# EAGLE design logic (EAGLE 8.4.3)
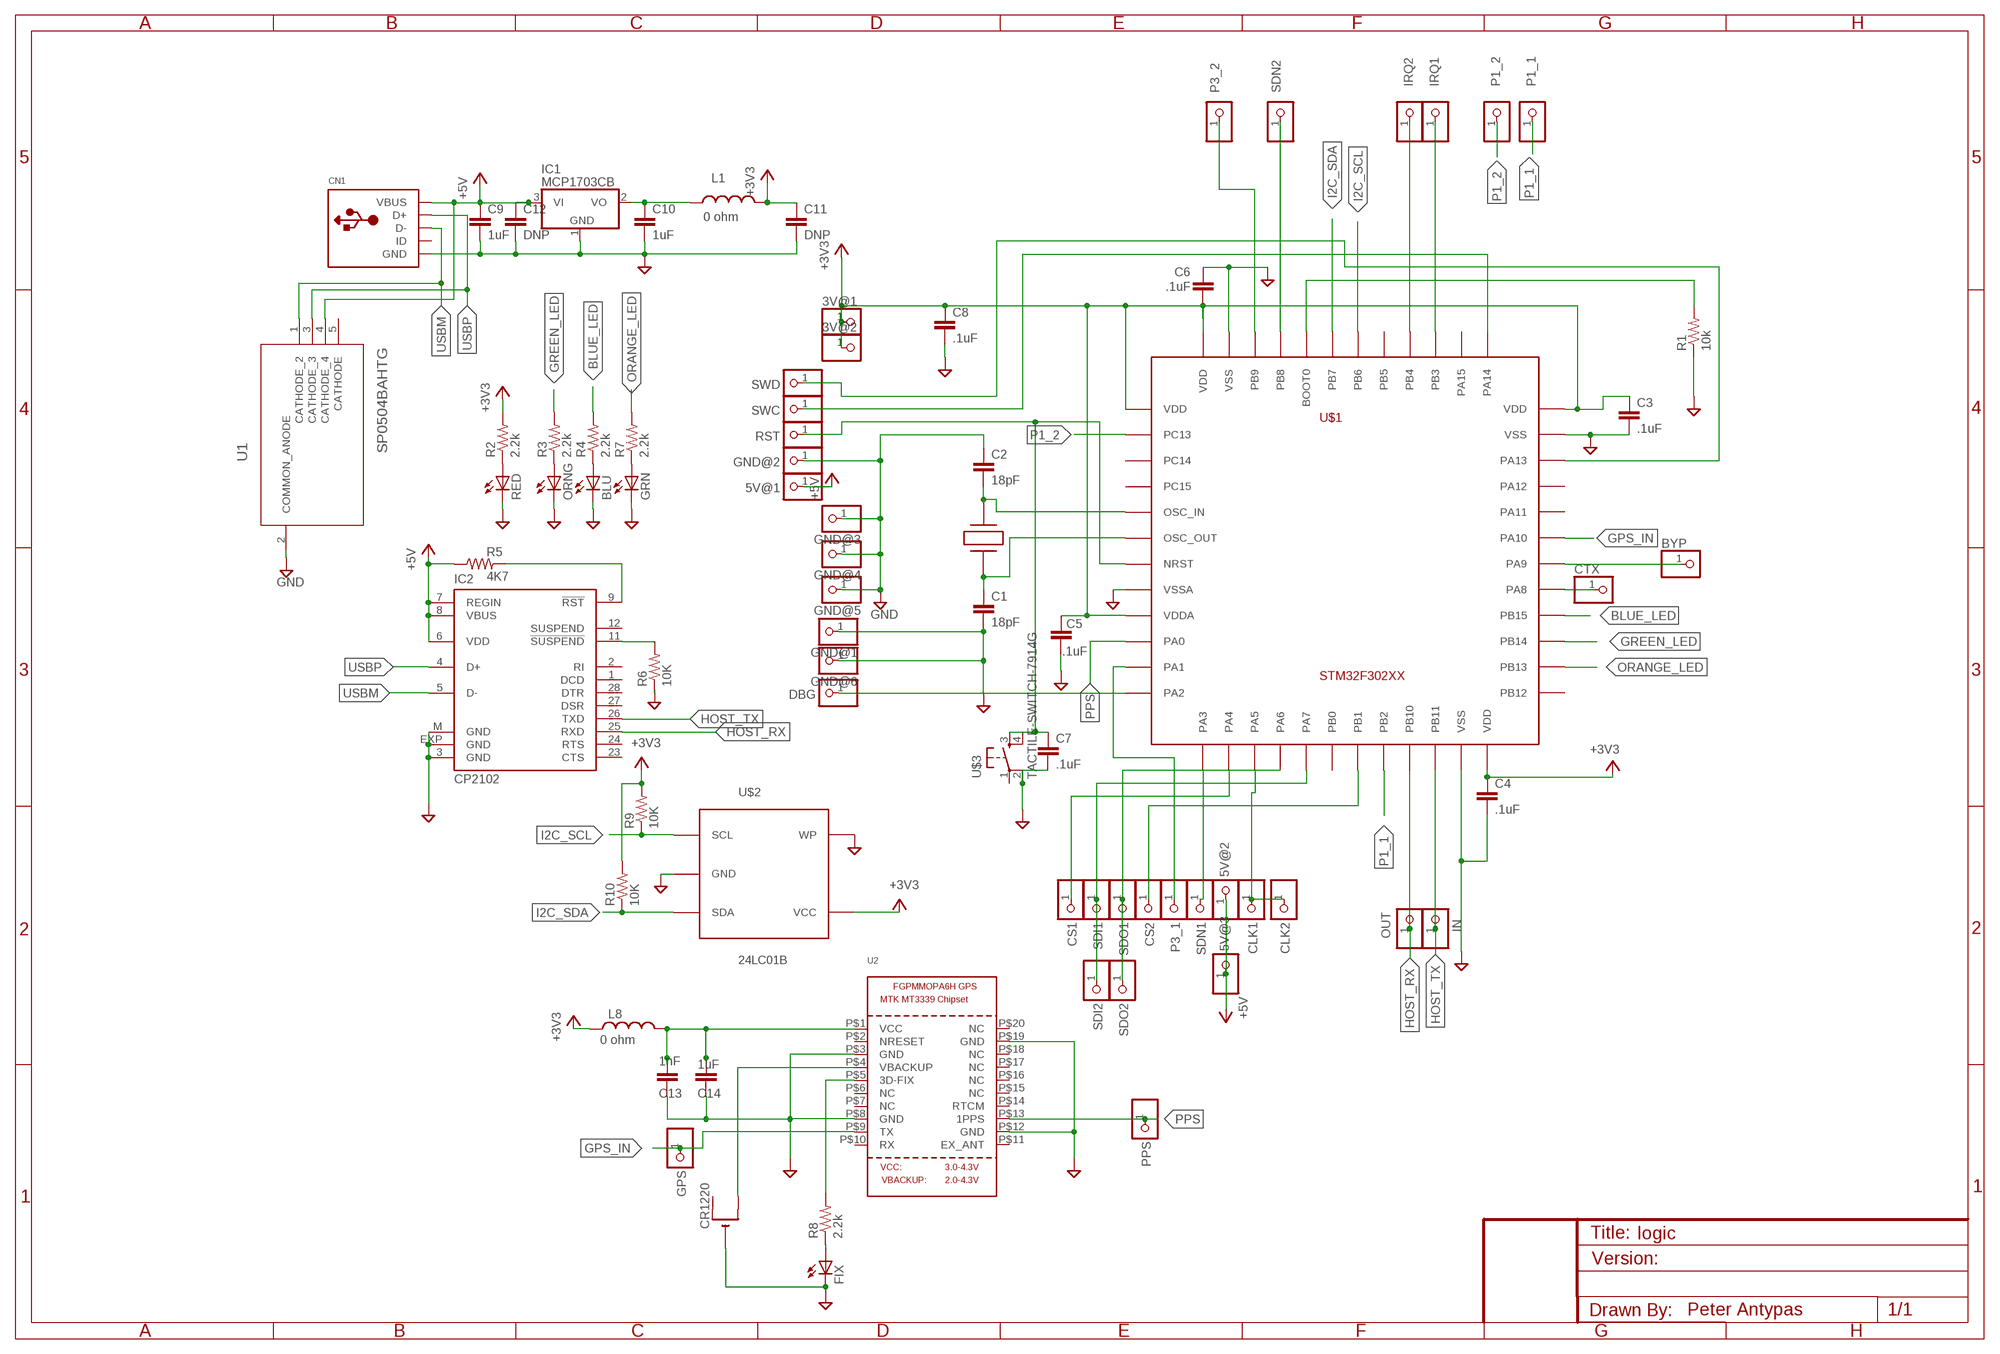
[diagram p0: schematic, sheet 1]

## Parts
3V@1  PINHD-1X1  [1X01]
3V@2  PINHD-1X1  [1X01]
5V@1  PINHD-1X1  [1X01]
5V@2  PINHD-1X1  [1X01]
5V@3  PINHD-1X1  [1X01]
BLU  LEDCHIP-LED0603  [CHIP-LED0603]
BYP  PINHD-1X1  [1X01]
C1  18pF  CAP0603-CAP  [0603-CAP]
C2  18pF  CAP0603-CAP  [0603-CAP]
C3  .1uF  CAP0603-CAP  [0603-CAP]
C4  .1uF  CAP0603-CAP  [0603-CAP]
C5  .1uF  CAP0603-CAP  [0603-CAP]
C6  .1uF  CAP0603-CAP  [0603-CAP]
C7  .1uF  CAP0603-CAP  [0603-CAP]
C8  .1uF  CAP0603-CAP  [0603-CAP]
C9  1uF  CAP0805  [0805]
C10  1uF  CAP0805  [0805]
C11  DNP  CAP0603-CAP  [0603-CAP]
C12  DNP  CAP0603-CAP  [0603-CAP]
C13  1nF  CAP0603-CAP  [0603-CAP]
C14  1uF  CAP0603-CAP  [0603-CAP]
CLK1  PINHD-1X1  [1X01]
CLK2  PINHD-1X1  [1X01]
CN1  USBMINIB  [USB-MINIB]
CR1220  CR1220SMT  [CR1220-SMD]
CS1  PINHD-1X1  [1X01]
CS2  PINHD-1X1  [1X01]
CTX  PINHD-1X1  [1X01]
DBG  PINHD-1X1  [1X01]
FIX  LEDCHIP-LED0603  [CHIP-LED0603]
GND@1  PINHD-1X1  [1X01]
GND@2  PINHD-1X1  [1X01]
GND@3  PINHD-1X1  [1X01]
GND@4  PINHD-1X1  [1X01]
GND@5  PINHD-1X1  [1X01]
GND@6  PINHD-1X1  [1X01]
GPS  PINHD-1X1  [1X01]
GRN  LEDCHIP-LED0603  [CHIP-LED0603]
IC1  MCP1703CB  [SOT23]
IC2  CP2102  [MLP28]
IN  PINHD-1X1  [1X01]
IRQ1  PINHD-1X1  [1X01]
IRQ2  PINHD-1X1  [1X01]
L1  0 ohm  INDUCTOR30OHM,1.8A  [0603]
L8  0 ohm  INDUCTOR0603  [0603]
ORNG  LEDCHIP-LED0603  [CHIP-LED0603]
OUT  PINHD-1X1  [1X01]
P1_1  PINHD-1X1  [1X01]
P1_2  PINHD-1X1  [1X01]
P3_1  PINHD-1X1  [1X01]
P3_2  PINHD-1X1  [1X01]
PPS  PINHD-1X1  [1X01]
R1  10k  RESISTOR0603-RES  [0603-RES]
R2  2.2k  RESISTOR0603-RES  [0603-RES]
R3  2.2k  RESISTOR0603-RES  [0603-RES]
R4  2.2k  RESISTOR0603-RES  [0603-RES]
R5  4K7  RESISTOR0603-RES  [0603-RES]
R6  10K  RESISTOR0603-RES  [0603-RES]
R7  2.2k  RESISTOR0603-RES  [0603-RES]
R8  2.2k  RESISTOR0603-RES  [0603-RES]
R9  10K  RESISTOR0603-RES  [0603-RES]
R10  10K  RESISTOR0603-RES  [0603-RES]
RED  LEDCHIP-LED0603  [CHIP-LED0603]
RST  PINHD-1X1  [1X01]
SDI1  PINHD-1X1  [1X01]
SDI2  PINHD-1X1  [1X01]
SDN1  PINHD-1X1  [1X01]
SDN2  PINHD-1X1  [1X01]
SDO1  PINHD-1X1  [1X01]
SDO2  PINHD-1X1  [1X01]
SWC  PINHD-1X1  [1X01]
SWD  PINHD-1X1  [1X01]
U1  SP0504BAHTG  [SOT95P280X145-5N]
U2  GPS_FGPMMOPA6H  [FGPMMOPA6H]
U$1  STM32F302XX  [LQFP48]
U$2  24LC01B  [SOT23-5]
U$3  TACTILE-SWITCH-7914G  [7914G]
X1  TXC_7A  [TXC_7A]

## Nets
+3V3: 3V@1.1 3V@2.1 C3.1 C4.1 C5.2 C6.1 C8.1 C11.1 L1.2 L8.1 R2.2 R9.2 R10.2 U$1.P$1(VDD) U$1.P$9(VDDA) U$1.P$24(VDD) U$1.P$36(VDD) U$1.P$48(VDD) U$2.4(VCC)
+5V: 5V@1.1 5V@2.1 5V@3.1 C9.1 C12.1 CN1.VBUS IC1.3(VI) IC2.6(VDD) IC2.7(REGIN) IC2.8(VBUS) R5.1 U1.4(CATHODE_4)
BLUE_LED: R4.2 U$1.P$28(PB15)
EEPROM_CS: C7.1 RST.1 U$1.P$7(NRST) U$3.3
GND: BLU.C C1.2 C2.1 C3.2 C4.2 C5.1 C6.2 C7.2 C8.2 C9.2 C10.2 C11.2 C12.2 C13.2 C14.2 CN1.GND CR1220.- FIX.C GND@1.1 GND@2.1 GND@3.1 GND@4.1 GND@5.1 GND@6.1 GRN.C IC1.1(GND) IC2.3(GND) IC2.EXP(GND) IC2.M(GND) ORNG.C R1.1 R6.1 U1.2(COMMON_ANODE) U2.P$3(GND) U2.P$8(GND) U2.P$12(GND) U2.P$19(GND) U$1.P$8(VSSA) U$1.P$23(VSS) U$1.P$35(VSS) U$1.P$47(VSS) U$2.2(GND) U$2.5(WP) U$3.2
GPS_IN: GPS.1 U2.P$9(TX) U$1.P$31(PA10)
GREEN_LED: R3.2 U$1.P$27(PB14)
HOST_RX: IC2.25(RXD) OUT.1 U$1.P$21(PB10)
HOST_TX: IC2.26(TXD) IN.1 U$1.P$22(PB11)
I2C_SCL: R9.1 U$1.P$42(PB6) U$2.1(SCL)
I2C_SDA: R10.1 U$1.P$43(PB7) U$2.3(SDA)
N$1: SDN2.1 U$1.P$45(PB8)
N$2: P3_1.1 U$1.P$11(PA1)
N$3: C10.1 IC1.2(VO) L1.1
N$4: R1.2 U$1.P$44(BOOT0)
N$5: SWC.1 U$1.P$37(PA14)
N$6: SDN1.1 U$1.P$13(PA3)
N$7: SWD.1 U$1.P$34(PA13)
N$8: IRQ1.1 U$1.P$39(PB3)
N$9: C2.2 U$1.P$5(OSC_IN) X1.P$2
N$10: CS1.1 U$1.P$14(PA4)
N$11: IRQ2.1 U$1.P$40(PB4)
N$12: FIX.A R8.1
N$13: CS2.1 U$1.P$19(PB1)
N$14: DBG.1 U$1.P$12(PA2)
N$15: P3_2.1 U$1.P$46(PB9)
N$16: R2.1 RED.A
N$17: ORNG.A R3.1
N$18: C1.1 U$1.P$6(OSC_OUT) X1.P$1
N$19: BLU.A R4.1
N$20: CTX.1 U$1.P$29(PA8)
N$21: IC2.9(!RST) R5.2
N$22: IC2.11(!SUSPEND) R6.2
N$23: GRN.A R7.1
N$24: BYP.1 U$1.P$30(PA9)
N$30: R8.2 U2.P$5(3D-FIX)
N$33: CR1220.+$2(+1) U2.P$4(VBACKUP)
ORANGE_LED: R7.2 U$1.P$26(PB13)
P1_1: P1_1.1 U$1.P$20(PB2)
P1_2: P1_2.1 U$1.P$2(PC13)
PPS: PPS.1 U2.P$13(1PPS) U$1.P$10(PA0)
PWR: RED.C ; supply symbol labelled GND
SDI: SDI1.1 SDI2.1 U$1.P$17(PA7)
SDO: SDO1.1 SDO2.1 U$1.P$16(PA6)
SPI_CLK: CLK1.1 CLK2.1 U$1.P$15(PA5)
USBM: CN1.D- IC2.5(D-) U1.1(CATHODE_2)
USBP: CN1.D+ IC2.4(D+) U1.3(CATHODE_3)
VDD1: C13.1 C14.1 L8.2 U2.P$1(VCC)
Unconnected: CN1.ID CR1220.+$1(+) IC2.1(DCD) IC2.2(RI) IC2.12(SUSPEND) IC2.23(CTS) IC2.24(RTS) IC2.27(DSR) IC2.28(DTR) U1.5(CATHODE) U2.P$2(NRESET) U2.P$6(NC) U2.P$7(NC) U2.P$10(RX) U2.P$11(EX_ANT) U2.P$14(RTCM) U2.P$15(NC) U2.P$16(NC) U2.P$17(NC) U2.P$18(NC) U2.P$20(NC) U$1.P$3(PC14) U$1.P$4(PC15) U$1.P$18(PB0) U$1.P$25(PB12) U$1.P$32(PA11) U$1.P$33(PA12) U$1.P$38(PA15) U$1.P$41(PB5) U$3.1 U$3.4

## Notes on the sheet
- Peter Antypas

## Library data of the parts
3V@1 3V@2 5V@1-5V@3 BYP CLK1 CLK2 CS1 CS2 CTX DBG GND@1-GND@6 GPS IN IRQ1 IRQ2 OUT P1_1 P1_2 P3_1 P3_2 PPS RST SDI1 SDI2 SDN1 SDN2 SDO1 SDO2 SWC SWD = adafruit:PINHD-1X1: Pin header 1x1 for 0.1" spacing With round pins
BLU FIX GRN ORNG RED = adafruit:LED: LED OSRAM: - CHIPLED LG R971, LG N971, LY N971, LG Q971, LY Q971, LO R971, LY R971 LH N974, LH R974 LS Q976, LO Q976, LY Q976 LO Q996 - Hyper CHIPLED LW Q18S LB Q993, LB Q99A, LB R99A - SideLED LS A670, LO A670, LY A670, LG A670, LP A670 LB A673, LV A673, LT A673, LW A673 LH A674 LY A675 LS A676, LA A676, LO A676, LY A676, LW A676 LS A679, LY A679, LG A679 - Hyper Micro SIDELED® LS Y876, LA Y876, LO Y876, LY Y876 LT Y87S - SmartLED LW L88C, LW L88S LB L89C, LB L89S, LG L890 LS L89K, LO L89K, LY L89K LS L896, LA L896, LO L896, LY L896 - TOPLED LS T670, LO T670, LY T670, LG T670, LP T670 LSG T670, LSP T670, LSY T670, LOP T670, LYG T670 LG T671, LOG T671, LSG T671 LB T673, LV T673, LT T673, LW T673 LH T674 LS T676, LA T676, LO T676, LY T676, LB T676, LH T676, LSB T676, LW T676 LB T67C, LV T67C, LT T67C, LS T67K, LO T67K, LY T67K, LW E67C LS E67B, LA E67B, LO E67B, LY E67B, LB E67C, LV E67C, LT E67C LW T67C LS T679, LY T679, LG T679 LS T770, LO T770, LY T770, LG T770, LP T770 LB T773, LV T773, LT T773, LW T773 LH T774 LS E675, LA E675, LY E675, LS T675 LS T776, LA T776, LO T776, LY T776, LB T776 LHGB T686 LT T68C, LB T68C - Hyper Mini TOPLED® LB M676 - Mini TOPLED Santana® LG M470 LS M47K, LO M47K, LY M47K Source: http://www.osram.convergy.de/
C1-C14 = SparkFun-Capacitors:CAP: Capacitor Standard 0603 ceramic capacitor, and 0.1" leaded capacitor.
CN1 = adafruit:USB: USB Connectors USBMINIB - Surface Mount Female Mini-B USB Connector 4UConnector: 06564 By microbuilder.eu Thru-hole RA Female Mini-B USB Connector 4UConnector: 18732 By ladyada.net
CR1220 = adafruit:CR1220: CR1216/CR1220/CR1225 12mm 3V lithium coin cell Great for battery packup. Both SMT and THM holders. Note the THM package has the ground pads on both sides of the PCB so that the masks are the same - this reduces the cost
IC1 = linear:MCP1703: 250 mA, 16V, Low Quiescent Current LDO Regulator Source: http://ww1.microchip.com/downloads/en/DeviceDoc/22049b.pdf
IC2 = silabs:CP210*: Single-Chip USB to UART Bridge Source: www.silabs.com .. CP2101.pdf / cp2102.pdf; MF: FARNELL; MPN: CP2102-GM; OC_FARNELL: 9282130; OC_NEWARK: 30K5635
L1 = SparkFun-Passives:INDUCTOR: Inductors Basic Inductor/Choke - 0603 and 1206. Footprints are not proven and vary greatly between part numbers. INDUCTOR POWER 3.3UH 4.0A SMD 0.197" L x 0.197" W x 0.177" H (5.00mm x 5.00mm x 4.50mm); PROD_ID: RES-07859
L8 = SparkFun-Passives:INDUCTOR: Inductors Basic Inductor/Choke - 0603 and 1206. Footprints are not proven and vary greatly between part numbers. INDUCTOR POWER 3.3UH 4.0A SMD 0.197" L x 0.197" W x 0.177" H (5.00mm x 5.00mm x 4.50mm)
R1-R10 = SparkFun-Passives:RESISTOR: Resistor Basic schematic elements and footprints for 0603, 1206, and PTH resistors.
U1 = Littelfuse_By_element14_Batch_1:SP0504BAHTG: SP05 Series - 30pF 30kV Unidirectional TVS Array; MPN: SP0504BAHTG; OC_FARNELL: 1827634; OC_NEWARK: 92K8961; PACKAGE: SOT-23-3; SUPPLIER: LITTELFUSE
U2 = adafruit:GPS_FGPMMOPA6H: GPS Module - MTK MT3339 Chipset, -165dBm sensitivity, 22 channels, 10Hz, auto-select external antenna options
U$1 = stm32:STM32F302XX: STM32 Cortex M4 MCU
U$2 = eeprom:24LC01B: 1KB I2C EEPROM
U$3 = GeekAmmo:TACTILE-SWITCH: Tactile Switch 4 Pins, SPST NO
X1 = txc:TXC_7A

## Board
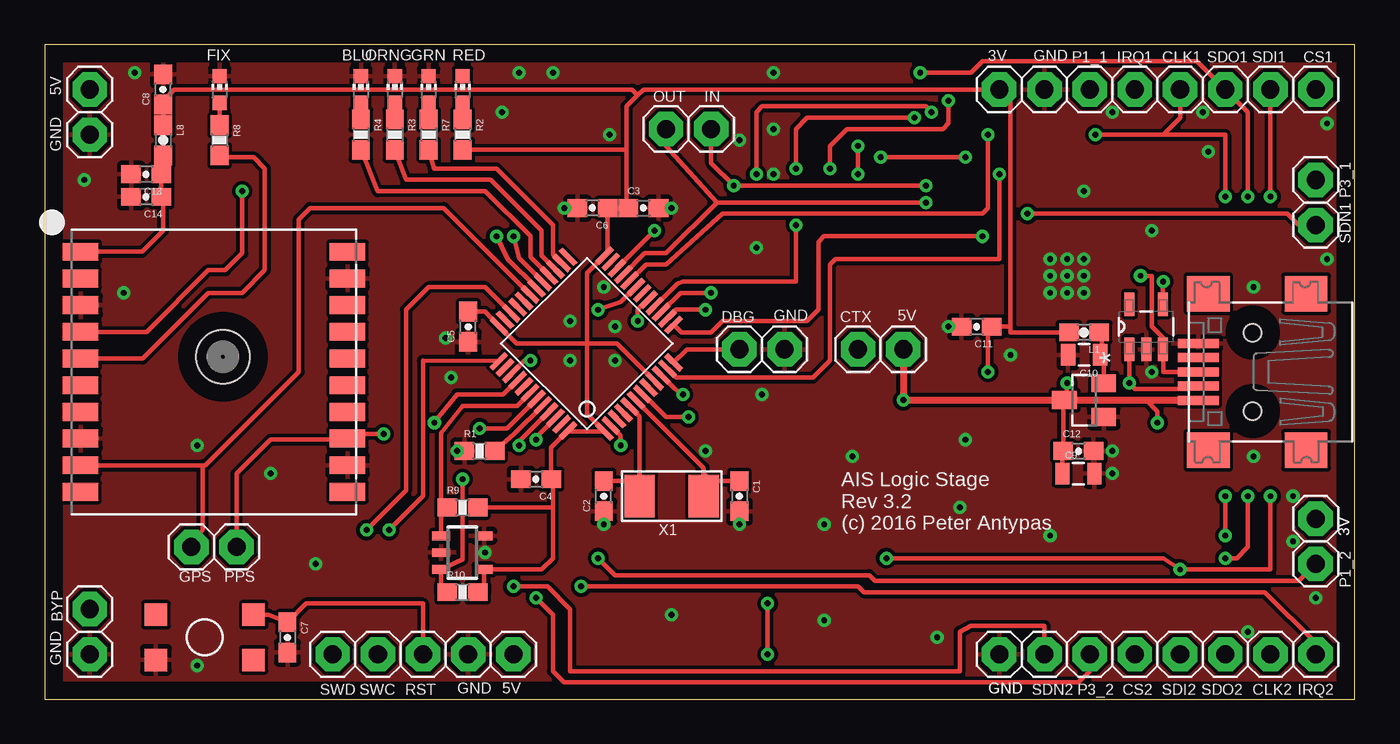
[diagram p1: board, top side]
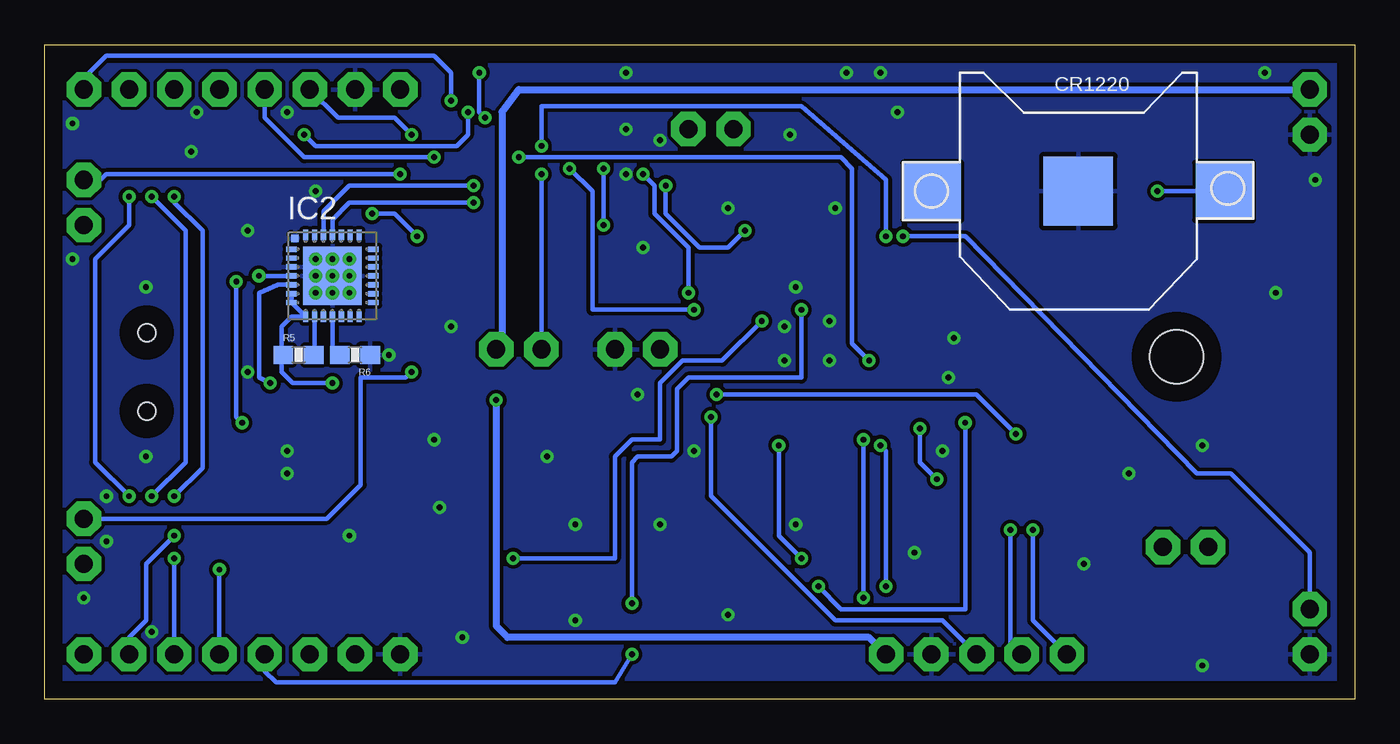
[diagram p2: board, bottom side, seen from below]

Size 73.65 x 36.82 mm. Coordinates in mm from the lower left corner, seen from the top.
Outline: 0,0 73.65,0 73.65,36.82 0,36.82 0,0
Copper layers (1*16): Top 0.035mm / dielectric 1.5mm / Bottom 0.035mm
Design rules "default *": minimum track width 10mil, minimum drill 24mil, track to track 8mil, track to pad 8mil, pad to pad 8mil, via to via 8mil, smd to smd 8mil, copper to edge 40mil, drill to drill 8mil, minimum pad ring 10mil, minimum via ring 8mil, stop-mask expansion 4mil, vias tented up to drill 10mm, thermal gap 10mil

### Footprints (pad centres in the part's own frame; a part is rotated, then mirrored left to right if it is on the bottom)
1X01 = drill 1.016 pad 1.93 octagon: 1 0,0
CHIP-LED0603 = smd 0.8 x 0.8: A 0,-0.75; C 0,0.75
0603-CAP = smd 1.1 x 1: 1 -0.85,0; 2 0.85,0
0805 = smd 0.8 x 1.2: 1 -0.9,0; 2 0.9,0
USB-MINIB = smd 0.5 x 2.308: D+ 0,4.064; D- -0.8,4.064; GND 1.6,4.064; ID 0.8,4.064; VBUS -1.6,4.064 | smd 2 x 2.4: GND1 -4.4,-2; GND2 -4.4,3.5; GND3 4.4,3.5; GND4 4.4,-2 | hole 1: -2.2,1; 2.2,1
CR1220-SMD = smd 3.2 x 3.2: +$1 -8.2,0; +$2 8.2,0 | smd 3.9 x 3.9: - 0,0
SOT23 = smd 1 x 1.4: 1 -0.95,-1.1; 2 0.95,-1.1; 3 0,1.1
MLP28 = smd 0.6 x 0.3: 1 -2.3,1.5; 2 -2.3,1; 3 -2.3,0.5; 4 -2.3,0; 5 -2.3,-0.5; 6 -2.3,-1; 7 -2.3,-1.5; 15 2.3,-1.5; 16 2.3,-1; 17 2.3,-0.5; 18 2.3,0; 19 2.3,0.5; 20 2.3,1; 21 2.3,1.5 | smd 0.3 x 0.6: 8 -1.5,-2.3; 9 -1,-2.3; 10 -0.5,-2.3; 11 0,-2.3; 12 0.5,-2.3; 13 1,-2.3; 14 1.5,-2.3; 22 1.5,2.3; 23 1,2.3; 24 0.5,2.3; 25 0,2.3; 26 -0.5,2.3; 27 -1,2.3; 28 -1.5,2.3 | smd 3.3 x 3.3: EXP 0,0 | smd 0.435 x 0.435: M -2.103,2.103
0603 = smd 1.1 x 1: 1 -0.85,0; 2 0.85,0
0603-RES = smd 1.1 x 1: 1 -0.85,0; 2 0.85,0
SOT95P280X145-5N = smd 1.321 x 0.559: 1 -1.27,0.94; 2 -1.27,0; 3 -1.27,-0.94; 4 1.27,-0.94; 5 1.27,0.94
FGPMMOPA6H = smd 2 x 1: P$1 -7.5,6.75; P$2 -7.5,5.25; P$3 -7.5,3.75; P$4 -7.5,2.25; P$5 -7.5,0.75; P$6 -7.5,-0.75; P$7 -7.5,-2.25; P$8 -7.5,-3.75; P$9 -7.5,-5.25; P$10 -7.5,-6.75; P$11 7.5,-6.75; P$12 7.5,-5.25; P$13 7.5,-3.75; P$14 7.5,-2.25; P$15 7.5,-0.75; P$16 7.5,0.75; P$17 7.5,2.25; P$18 7.5,3.75; P$19 7.5,5.25; P$20 7.5,6.75 | hole 3: 0.5,0.85
LQFP48 = smd 0.3 x 1.2: P$1 -2.8,-4.2; P$2 -2.3,-4.2; P$3 -1.8,-4.2; P$4 -1.3,-4.2; P$5 -0.8,-4.2; P$6 -0.3,-4.2; P$7 0.2,-4.2; P$8 0.7,-4.2; P$9 1.2,-4.2; P$10 1.7,-4.2; P$11 2.2,-4.2; P$12 2.7,-4.2; P$25 2.7,4.2; P$26 2.2,4.2; P$27 1.7,4.2; P$28 1.2,4.2; P$29 0.7,4.2; P$30 0.2,4.2; P$31 -0.3,4.2; P$32 -0.8,4.2; P$33 -1.3,4.2; P$34 -1.8,4.2; P$35 -2.3,4.2; P$36 -2.8,4.2 | smd 1.2 x 0.3: P$13 4.2,-2.7; P$14 4.2,-2.2; P$15 4.2,-1.7; P$16 4.2,-1.2; P$17 4.2,-0.7; P$18 4.2,-0.2; P$19 4.2,0.3; P$20 4.2,0.8; P$21 4.2,1.3; P$22 4.2,1.8; P$23 4.2,2.3; P$24 4.2,2.8; P$37 -4.2,2.8; P$38 -4.2,2.3; P$39 -4.2,1.8; P$40 -4.2,1.3; P$41 -4.2,0.8; P$42 -4.2,0.3; P$43 -4.2,-0.2; P$44 -4.2,-0.7; P$45 -4.2,-1.2; P$46 -4.2,-1.7; P$47 -4.2,-2.2; P$48 -4.2,-2.7
SOT23-5 = smd 0.5 x 1: 1 -0.95,-1.2; 2 0,-1.2; 3 0.95,-1.2; 4 0.95,1.2; 5 -0.95,1.2
7914G = smd 1.27 x 1.27: 1 0,0; 2 0,5.486; 3 2.54,0; 4 2.54,5.486
TXC_7A = smd 1.7 x 2.4: P$1 -1.8,0; P$2 1.8,0

### Placement (x,y rotation side)
3V@1  71.44,10.16 0 top
3V@2  53.66,34.29 0 top
5V@1  2.54,34.29 0 top
5V@2  26.35,2.54 0 top
5V@3  48.26,19.68 0 top
BLU  17.78,34.29 0 top
BYP  2.54,5.08 0 top
C1  39.05,11.43 270 top
C2  31.43,11.43 90 top
C3  33.66,27.62 0 top
C4  27.62,12.38 180 top
C5  23.81,20.95 90 top
C6  30.8,27.62 180 top
C7  13.65,3.49 270 top
C8  6.67,34.29 90 top
C9  58.1,12.7 0 top
C10  58.42,19.37 180 top
C11  52.39,20.95 180 top
C12  58.1,13.97 0 top
C13  5.71,29.53 180 top
C14  5.71,28.26 180 top
CLK1  63.82,34.29 0 top
CLK2  68.9,2.54 0 top
CN1  68.9,18.41 90 top
CR1220  15.56,28.57 0 bottom
CS1  71.44,34.29 0 top
CS2  61.28,2.54 0 top
CTX  45.72,19.68 0 top
DBG  39.05,19.68 0 top
FIX  9.84,34.29 0 top
GND@1  2.54,2.54 0 top
GND@2  53.66,2.54 0 top
GND@3  2.54,31.75 0 top
GND@4  56.2,34.29 0 top
GND@5  23.81,2.54 0 top
GND@6  41.59,19.68 0 top
GPS  8.26,8.57 0 top
GRN  21.59,34.29 0 top
IC1  58.42,16.83 90 top
IC2  57.47,23.81 0 bottom
IN  37.47,32.07 0 top
IRQ1  61.28,34.29 0 top
IRQ2  71.44,2.54 0 top
L1  58.42,20.64 180 top
L8  6.67,31.43 270 top
ORNG  19.68,34.29 0 top
OUT  34.92,32.07 0 top
P1_1  58.74,34.29 0 top
P1_2  71.44,7.62 0 top
P3_1  71.44,29.21 0 top
P3_2  58.74,2.54 0 top
PPS  10.79,8.57 0 top
R1  24.45,13.97 0 top
R2  23.5,31.75 270 top
R3  19.68,31.75 270 top
R4  17.78,31.75 270 top
R5  59.37,19.37 0 bottom
R6  56.2,19.37 180 bottom
R7  21.59,31.75 270 top
R8  9.84,31.43 270 top
R9  23.5,10.79 0 top
R10  23.5,6.03 0 top
RED  23.5,34.29 0 top
RST  21.27,2.54 0 top
SDI1  68.9,34.29 0 top
SDI2  63.82,2.54 0 top
SDN1  71.44,26.67 0 top
SDN2  56.2,2.54 0 top
SDO1  66.36,34.29 0 top
SDO2  66.36,2.54 0 top
SWC  18.73,2.54 0 top
SWD  16.19,2.54 0 top
U1  61.91,20.95 90 top
U2  9.53,18.41 0 top
U$1  30.48,20 45 top
U$2  23.5,8.26 270 top
U$3  11.75,2.22 90 top
X1  35.24,11.43 180 top

### Tracks (layer width: path | path; a pad name or v marks a point on that pad's centre or on a via)
+3V3  (via drill 0.33)
  Top 0.254: 30.48,20 26.52,20 U$1.P$36 24.75,21.8 C5.2 | 30.48,20 30.48,23.96 U$1.P$24 31.65,25.13 C6.1 C3.1 32.7,27.73 32.7,30.8 | U$1.P$9 32.18,20 30.48,20 | 30.48,20 30.48,16.04 U$1.P$1 29.49,15.05 U$1.P$48 28.47,14.18 C4.1 28.57,12.28 28.57,10.79 | L1.2 54.29,20.64 54.29,20.95 | 54.29,20.95 54.29,33.66 3V@2.1 33.66,34.29 33.34,33.97 | 33.34,33.97 32.7,33.34 32.7,30.8 | 28.57,10.79 28.57,7.94 27.94,7.3 U$2.4 24.7,6.38 | 54.29,20.95 C11.1 53.02,20.74 v53.02,18.41 | L8.1 C8.1 6.67,33.66 7.3,34.29 33.02,34.29 33.34,33.97 | R2.2 32.6,30.9 32.7,30.8 | R9.2 28.57,10.79
  Top 0.406: R10.2 24.7,6.03 24.7,6.38
  Bottom 0.254: 3V@1.1 57.78,10.16 55.88,12.06 55.88,18.1 53.34,18.1 v53.02,18.41
+5V  (via drill 0.33)
  Top 0.254: 64.82,16.83 CN1.VBUS | C9.1 57.2,13.92 C12.1 57.25,16.76 IC1.3 57.47,16.98 v57.47,17.78 | U1.4 62.85,23.48 v62.87,23.5 | v62.55,15.56 62.55,16.19 61.91,16.83
  Top 0.406: 64.82,16.83 61.91,16.83 IC1.3 v48.26,16.83 5V@3.1
  Bottom 0.254: v62.87,23.5 62.87,15.88 v62.55,15.56 | IC2.6 IC2.7 IC2.8 59.77,21.51 60.33,20.95 60.33,19.58 | 60.33,19.58 R5.1 | 60.33,19.58 60.33,18.41 59.69,17.78 v57.47,17.78
  Bottom 0.406: 5V@1.1 46.99,34.29 47.94,33.02 47.94,20 5V@3.1 | v48.26,16.83 48.26,4.13 47.62,3.49 27.3,3.49 5V@2.1
BLUE_LED
  Top 0.254: U$1.P$28 27.3,24.88 27.3,26.04 24.77,28.57 18.73,28.57 R4.2
EEPROM_CS  (via drill 0.33)
  Top 0.254: U$3.3 12.6,4.76 C7.1 14.71,5.4 21.27,5.4 RST.1 | U$1.P$7 33.63,17.17 34.92,15.88 v36.2,15.88
  Bottom 0.254: v36.2,15.88 36.2,11.43 29.21,4.45 23.18,4.45 RST.1
GND  (via drill 0.33)
  other vias: 29.53,21.27 31.43,23.18 32.07,20.95 29.53,19.05 62.23,18.41 57.47,23.81 56.52,24.77 57.47,24.77 58.42,24.77 57.47,22.86 56.52,22.86 58.42,22.86 58.42,23.81 56.52,23.81 65.09,33.02 58.42,28.57 62.23,26.35 72.07,24.77 54.29,19.37 65.41,30.8 32.07,19.05 29.21,27.62 35.24,27.62 37.15,13.97 22.54,20.32 35.24,4.76 43.81,4.45 50.16,3.49 56.52,9.21 45.4,13.65 60.01,33.02 72.07,32.38 70.17,8.89 60.01,12.7 60.01,13.97 67.63,3.81 70.17,11.43 71.44,5.71 67.94,23.18 67.94,13.65 40.01,25.4 28.57,35.24 40.32,17.14 8.57,1.91 5.08,35.24 26.67,35.24 40.96,35.24 8.57,14.29 2.22,29.21 4.45,22.86 25.72,33.02 40.96,32.07 39.05,31.43 40.96,29.53 22.86,18.1 24.77,8.26 23.18,13.97 50.8,20.95 31.43,9.84 39.05,9.84 31.75,31.75 51.44,10.79 51.75,14.61 43.81,9.84 12.7,12.7 15.24,7.62
  pour Top: -0.95,37.47 74.61,37.47 74.61,-0.95 -0.95,-0.95
  pour Bottom: -1.91,38.1 75.56,38.1 75.56,-1.91 -1.91,-1.91
GPS_IN
  Top 0.254: U2.P$9 8.89,13.16 | 8.89,13.16 9.04,13.16 14.29,18.41 14.29,26.99 14.92,27.62 22.44,27.62 U$1.P$31 | GPS.1 8.89,9.53 8.89,13.16
GREEN_LED
  Top 0.254: U$1.P$27 27.94,24.95 27.94,26.35 25.08,29.21 20.32,29.21 R3.2
HOST_RX  (via drill 0.33)
  Top 0.254: v49.53,27.94 37.78,27.94 | 37.78,27.94 34.92,31.11 OUT.1 | 37.78,27.94 34.92,25.08 33.72,25.08 U$1.P$21
  Bottom 0.254: IC2.25 57.47,26.99 56.52,27.94 v49.53,27.94
HOST_TX  (via drill 0.33)
  Top 0.254: v49.53,28.89 v38.73,28.89 37.47,30.16 IN.1 | v34.29,26.35 v34.28,26.35 U$1.P$22
  Bottom 0.254: IC2.26 57.97,27.44 56.52,28.89 v49.53,28.89 | v38.73,28.89 38.73,27.3 36.83,25.4 35.24,25.4 v34.29,26.35
I2C_SCL
  Top 0.254: U$2.1 22.3,10.48 22.3,10.79 | 22.3,10.79 22.3,14.99 23.5,16.51 26.56,16.51 U$1.P$42 | R9.1 22.3,10.79
I2C_SDA  (via drill 0.33)
  Top 0.254: v23.5,12.38 23.5,7.87 U$2.3 22.3,6.38 | v24.45,15.24 26,15.24 U$1.P$43
  Top 0.406: R10.1 22.3,6.03 22.3,6.38
  Bottom 0.254: v23.5,12.38 24.45,13.34 v24.45,15.24
N$1  (via drill 0.33)
  Top 0.254: U$1.P$45 26.67,14.49 v26.67,14.29 | v26.35,6.35 28.26,6.35 29.53,5.08 29.53,1.59 51.44,1.59 51.44,3.81 52.07,4.13 56.2,4.13 SDN2.1
  Bottom 0.254: v26.67,14.29 26.35,13.97 v26.35,6.35
N$2  (via drill 0.33)
  Top 0.254: U$1.P$11 35.5,18.1 43.18,18.1 44.13,19.05 44.13,24.45 44.45,24.77 53.66,24.77 v53.66,29.53
  Bottom 0.254: v53.66,29.53 70.17,29.53 70.48,29.21 P3_1.1
N$3
  Top 0.254: IC1.2 59.52,19.37 | 59.52,19.37 59.52,19.62 L1.1 | C10.1 59.52,19.37
N$4
  Top 0.254: R1.2 26.39,14.92 U$1.P$44
N$5  (via drill 0.33)
  Top 0.254: U$1.P$37 25.36,19.01 21.27,19.05 21.27,11.43 v19.37,9.53
  Bottom 0.254: v19.37,9.53 19.37,3.17 SWC.1
N$6  (via drill 0.33)
  Top 0.254: U$1.P$13 35.78,20.64 37.47,20.64 38.1,21.27 42.86,21.27 43.5,21.91 43.5,25.72 43.81,26.04 v52.7,26.04 | v55.24,27.3 69.85,27.3 70.48,26.67 SDN1.1
  Bottom 0.254: v52.7,26.04 53.98,27.3 v55.24,27.3
N$7  (via drill 0.33)
  Top 0.254: U$1.P$34 24.77,23.18 21.59,23.18 20.32,21.91 20.32,11.75 v18.1,9.53
  Bottom 0.254: v18.1,9.53 18.1,4.45 SWD.1
N$8  (via drill 0.33)
  Top 0.254: U$1.P$39 26.98,19.05 v27.3,19.05 | v46.99,30.48 v51.75,30.48
  Bottom 0.254: v27.3,19.05 28.26,20 28.26,29.84 28.89,30.48 v46.99,30.48 | v51.75,30.48 59.05,30.48 61.28,32.7 IRQ1.1
N$9
  Top 0.254: U$1.P$5 33.44,15.91 33.44,12.38 | 33.44,12.38 X1.P$2 | C2.2 33.34,12.28 33.44,12.38
N$10  (via drill 0.33)
  Top 0.254: U$1.P$14 35.5,21.91 v37.15,21.91 | v50.8,33.66 50.8,32.38 50.48,32.07 45.09,32.07 44.13,31.11 v44.13,29.84
  Bottom 0.254: v37.15,21.91 42.86,21.91 42.86,28.57 v44.13,29.84 | v50.8,33.66 50.8,35.24 51.75,36.2 70.17,36.2 71.44,34.92 CS1.1
N$11  (via drill 0.33)
  Top 0.254: U$1.P$40 25.78,17.14 23.18,17.14 v21.91,15.56 | v30.16,6.35 45.72,6.35 46.04,6.03 68.58,6.03 71.44,3.17 IRQ2.1
  Bottom 0.254: v21.91,15.56 21.91,5.08 28.89,5.08 v30.16,6.35
N$12
  Top 0.254: R8.1 FIX.A
N$13  (via drill 0.33)
  Top 0.254: U$1.P$19 32.38,22.33 v31.11,21.91 | v40.64,2.54 v40.64,5.4
  Bottom 0.254: v31.11,21.91 31.11,18.1 37.47,18.1 38.1,17.46 38.1,13.97 38.42,13.65 40.32,13.65 40.64,13.34 v40.64,5.4 | v40.64,2.54 41.59,0.95 60.64,0.95 61.28,1.59 CS2.1
N$14
  Top 0.254: U$1.P$12 36.1,19.68 DBG.1
N$15  (via drill 0.33)
  Top 0.254: U$1.P$46 27.62,14.74 v27.62,14.61 | v27.62,5.71 28.57,4.76 28.57,1.59 29.21,0.95 58.1,0.95 58.74,1.59 P3_2.1
  Bottom 0.254: v27.62,14.61 v27.62,5.71
N$16
  Top 0.254: R2.1 23.51,32.91 RED.A
N$17
  Top 0.254: R3.1 ORNG.A
N$18
  Top 0.254: U$1.P$6 37.04,13.02 37.04,12.7 | 37.04,12.7 X1.P$1 | C1.1 37.46,12.28 37.04,12.7
N$19
  Top 0.254: R4.1 BLU.A
N$20  (via drill 0.33)
  Top 0.254: U$1.P$29 26.67,24.8 v26.35,26.04 | v45.72,31.11 v45.72,29.53
  Bottom 0.254: v45.72,31.11 45.72,33.34 31.11,33.34 26.35,29.21 v26.35,26.04 | v45.72,29.53 CTX.1
N$21
  Bottom 0.254: IC2.9 58.47,19.42 R5.2
N$22
  Bottom 0.254: IC2.11 57.47,19.47 R6.2
N$23
  Top 0.254: R7.1 GRN.A
N$24  (via drill 0.33)
  Top 0.254: U$1.P$30 27.65,23.15 26.04,24.77 v25.4,26.04
  Bottom 0.254: v25.4,26.04 21.91,26.04 8.89,12.7 6.99,12.7 2.54,8.26 BYP.1
N$30
  Top 0.254: R8.2 9.95,30.48 11.75,30.48 12.38,29.84 12.38,24.13 11.11,22.86 9.21,22.86 5.51,19.16 U2.P$5
N$33  (via drill 0.33)
  Top 0.254: U2.P$4 5.74,20.66 9.21,24.13 10.16,24.13 11.11,25.08 v11.11,28.57
  Bottom 0.254: v11.11,28.57 CR1220.+$2
ORANGE_LED
  Top 0.254: U$1.P$26 28.57,25.02 28.57,26.67 25.4,29.84 21.91,29.84 R7.2 21.38,30.8
P1_1  (via drill 0.33)
  Top 0.254: U$1.P$20 33.79,24.45 34.92,24.45 38.1,27.3 52.7,27.3 53.02,27.62 v53.02,31.75
  Bottom 0.254: v53.02,31.75 53.98,32.7 57.15,32.7 P1_1.1
P1_2  (via drill 0.33)
  Top 0.254: U$1.P$2 32.38,14.85 v32.38,14.29 | v31.11,7.94 32.07,6.99 46.35,6.99 46.67,6.67 70.48,6.67 P1_2.1
  Bottom 0.254: v32.38,14.29 32.38,9.21 v31.11,7.94
PPS  (via drill 0.33)
  Top 0.254: v35.88,17.14 35.42,17.46 U$1.P$10 | v19.05,14.92 17.28,14.92 U2.P$13 16.96,14.61 12.7,14.61 10.79,12.7 PPS.1
  Bottom 0.254: v35.88,17.14 21.27,17.14 v19.05,14.92
SDI  (via drill 0.33)
  Top 0.254: SDI1.1 v68.9,28.26 | v68.9,11.43 68.9,7.3 v63.82,7.3 62.87,7.94 v47.31,7.94 | U$1.P$17 33.91,22.48 33.34,21.91 v33.34,21.27
  Bottom 0.254: v63.82,7.3 SDI2.1 | v33.34,21.27 35.56,19.05 37.78,19.05 39.05,17.78 39.05,14.61 40.64,14.61 41.59,13.65 41.59,7.94 v47.31,7.94 | v68.9,28.26 68.9,26.67 70.8,24.77 70.8,13.34 v68.9,11.43
SDO  (via drill 0.33)
  Top 0.254: U$1.P$16 35.56,23.39 35.88,23.5 42.23,23.5 v42.23,26.67 | v42.23,29.84 42.23,32.07 42.86,32.7 v48.9,32.7 | v49.21,35.24 52.07,35.24 52.7,35.88 64.77,35.88 SDO1.1 67.63,33.02 v67.63,28.26 | v67.63,11.43 67.63,8.57 66.99,7.94 v66.36,7.94
  Bottom 0.254: v42.23,26.67 v42.23,29.84 | v48.9,32.7 49.21,33.02 v49.21,35.24 | v66.36,7.94 SDO2.1 | v67.63,28.26 65.72,26.35 65.72,13.34 v67.63,11.43
SPI_CLK  (via drill 0.33)
  Top 0.254: v40.01,29.53 40.01,33.02 40.32,33.34 49.53,33.34 v49.85,33.02 | v59.05,31.75 62.87,31.75 | 62.87,31.75 63.82,32.7 CLK1.1 | 62.87,31.75 66.36,31.75 v66.36,28.26 | v66.36,11.43 v66.36,9.21 | v37.47,22.86 35.74,22.86 U$1.P$15
  Bottom 0.254: v40.01,29.53 39.37,28.89 39.37,27.3 37.47,25.4 v37.47,22.86 | v49.85,33.02 49.85,31.75 50.48,31.11 58.42,31.11 v59.05,31.75 | v66.36,9.21 67.94,7.62 67.94,4.45 68.9,3.49 CLK2.1 | v66.36,28.26 66.36,27.94 64.77,26.35 64.77,13.02 v66.36,11.43
USBM  (via drill 0.33)
  Top 0.254: U1.1 60.97,18.09 60.96,18.07 v60.96,17.78 61.28,17.46 64.35,17.46 64.5,17.61 CN1.D-
  Bottom 0.254: IC2.5 60.51,23.31 61.59,22.86 61.59,18.1 v60.96,17.78
USBP  (via drill 0.33)
  Top 0.254: CN1.D+ 62.87,18.41 62.87,19.67 | 62.87,19.67 U1.3 | 62.87,19.67 62.87,20.32 62.23,20.95 62.23,23.81 v61.59,23.81
  Bottom 0.254: v61.59,23.81 IC2.4
VDD1
  Top 0.254: C13.1 C14.1 | C14.1 6.57,30.48 L8.2 | U2.P$1 5.48,25.16 6.67,26.35 6.67,28.16 C14.1

### Text on the board
tNames: 3V | GND | 5V | GND | GND | 5V | AIS Logic Stage / Rev 3.2 / (c) 2016 Peter Antypas | 3V | 3V | GND | GND | 5V | GND | GND